# EAGLE design controle digital (EAGLE 4.09)
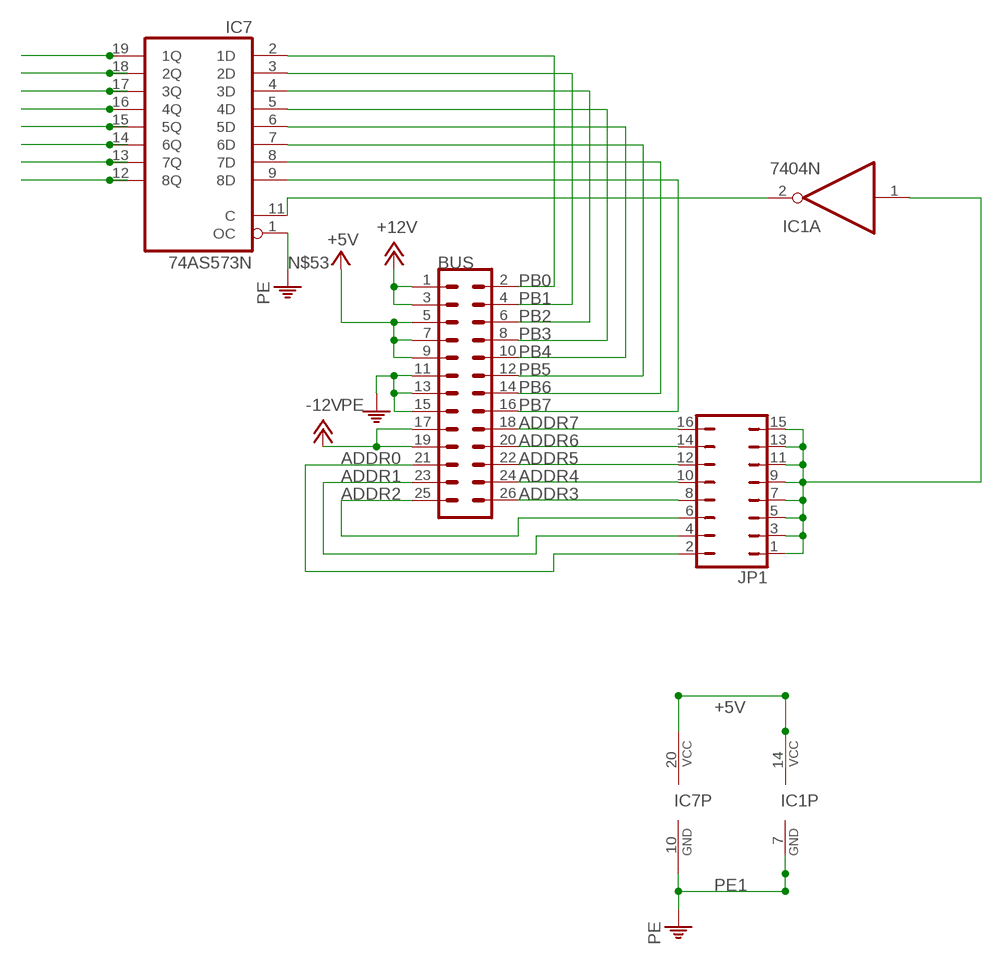
[diagram p0: schematic, sheet 1]

## Parts
BUS  ML26  [ML26]
IC1  7404N  [DIL14]
IC7  74AS573N  [DIL20]
JP1  JP8Q  [JP8Q]

## Nets
+5V: BUS.5 BUS.7 BUS.9 IC1.14(P:VCC) IC7.20(VCC)
+12V: BUS.1 BUS.3
-12V: BUS.17 BUS.19
ADDR0: BUS.21 JP1.2
ADDR1: BUS.23 JP1.4
ADDR2: BUS.25 JP1.6
ADDR3: BUS.26 JP1.8
ADDR4: BUS.24 JP1.10
ADDR5: BUS.22 JP1.12
ADDR6: BUS.20 JP1.14
ADDR7: BUS.18 JP1.16
N$1: IC7.19(1Q)
N$2: IC7.18(2Q)
N$3: IC7.17(3Q)
N$4: IC7.16(4Q)
N$5: IC7.15(5Q)
N$6: IC7.14(6Q)
N$7: IC7.13(7Q)
N$8: IC7.12(8Q)
N$33: IC1.1(A:I) JP1.1 JP1.3 JP1.5 JP1.7 JP1.9 JP1.11 JP1.13 JP1.15
N$53: IC1.2(A:O) IC7.11(C)
PB0: BUS.2 IC7.2(1D)
PB1: BUS.4 IC7.3(2D)
PB2: BUS.6 IC7.4(3D)
PB3: BUS.8 IC7.5(4D)
PB4: BUS.10 IC7.6(5D)
PB5: BUS.12 IC7.7(6D)
PB6: BUS.14 IC7.8(7D)
PB7: BUS.16 IC7.9(8D)
PE1: BUS.11 BUS.13 BUS.15 IC1.7(P:GND) IC7.1(OC) IC7.10(GND) ; supply symbol labelled PE
Unconnected: IC1.3(B:I) IC1.4(B:O) IC1.5(C:I) IC1.6(C:O) IC1.8(D:O) IC1.9(D:I) IC1.10(E:O) IC1.11(E:I) IC1.12(F:O) IC1.13(F:I)

## Library data of the parts
BUS = con-harting-ml:ML26: HARTING
IC1 = 74xx-us:74*04: Hex INVERTER
IC7 = 74xx-us:74*573: 8-bit D latch BUS DRIVER
JP1 = jumper:JP8Q: JUMPER

## Board
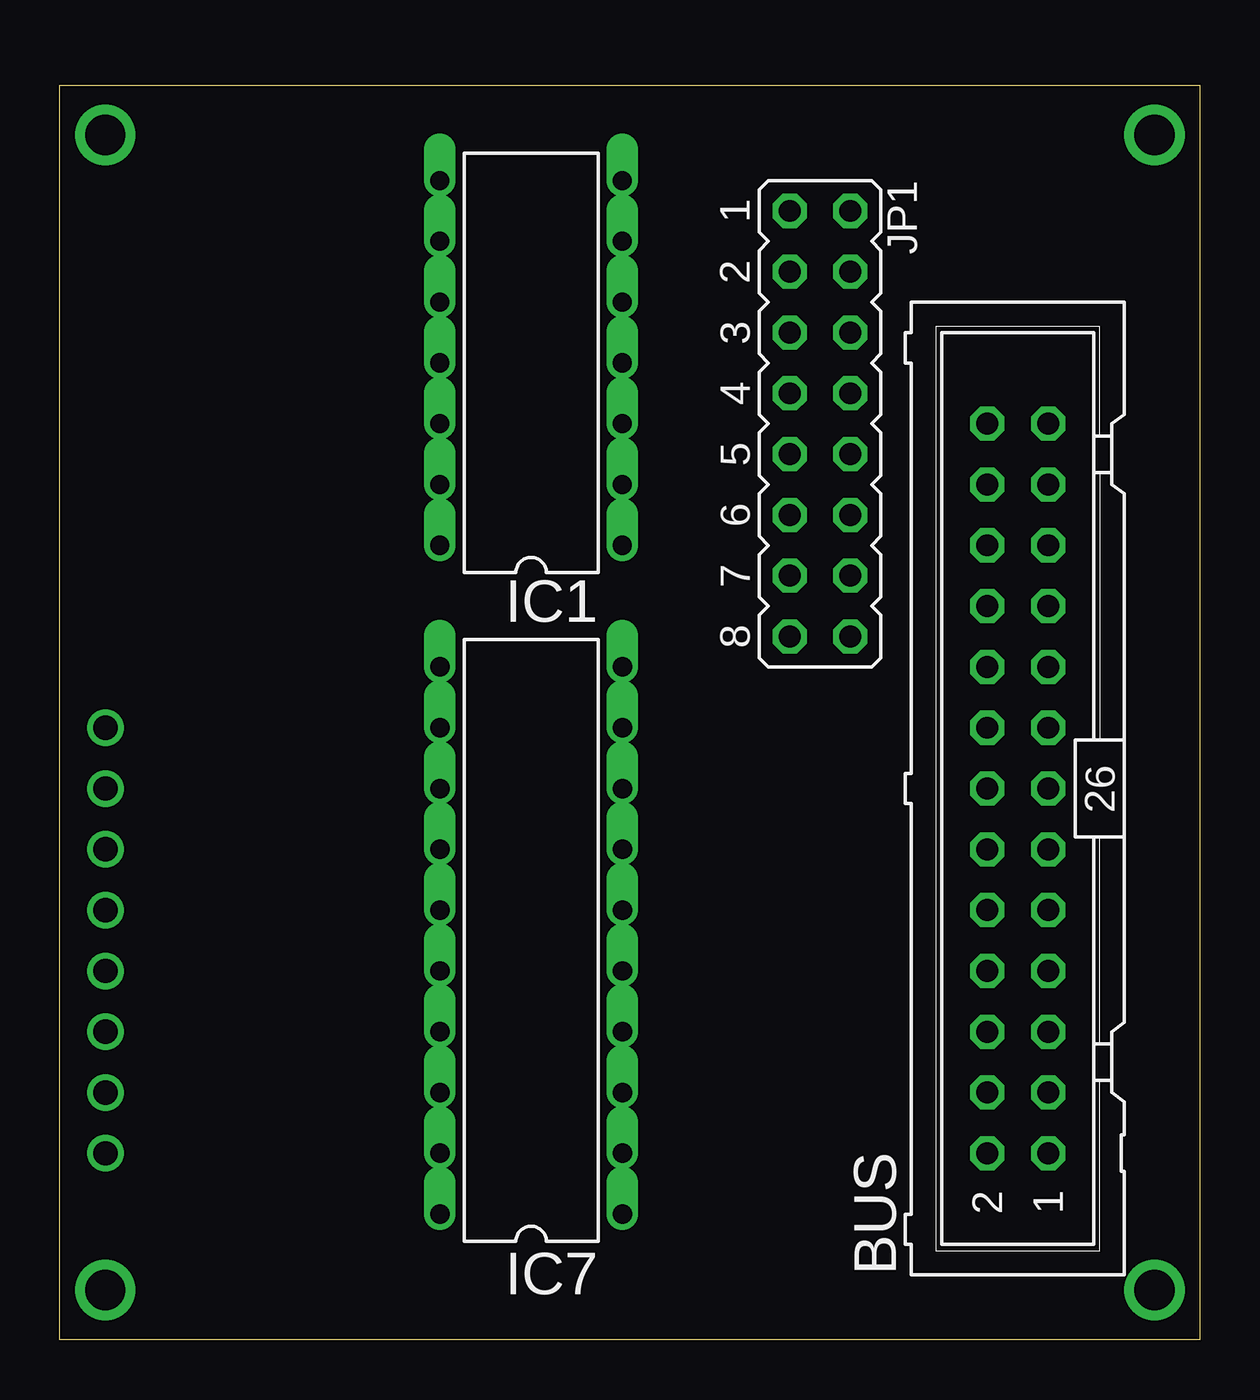
[diagram p1: board, top side]
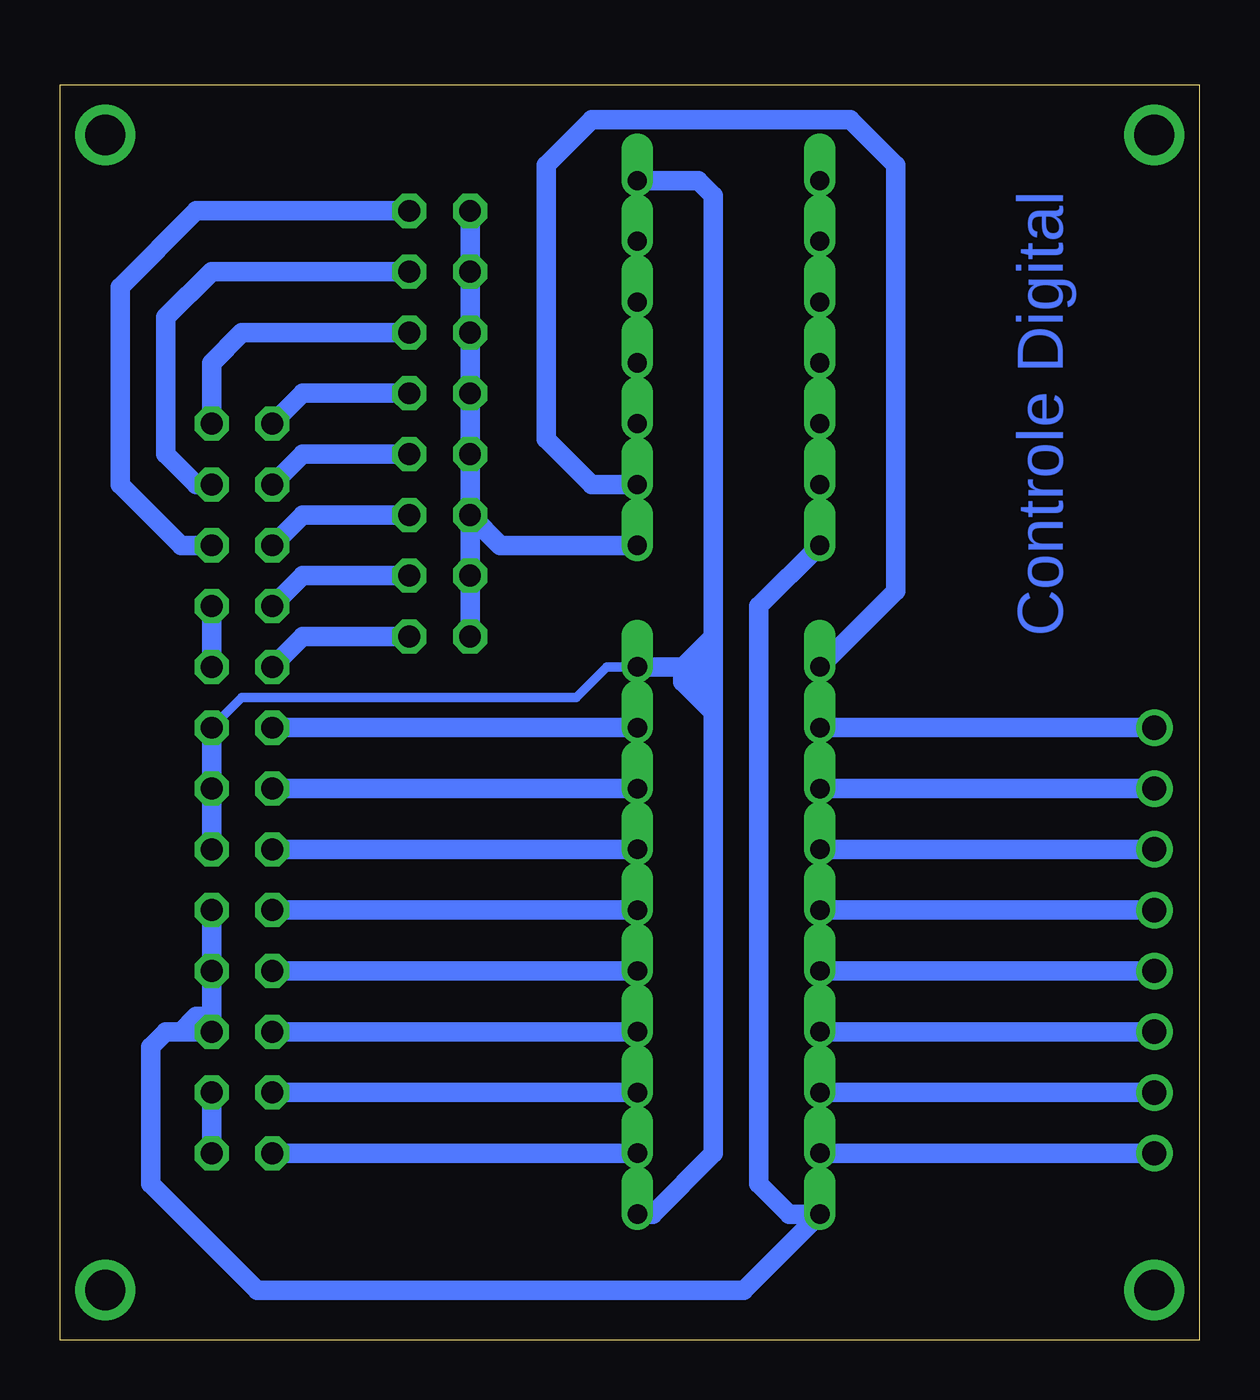
[diagram p2: board, bottom side, seen from below]

Size 47.6 x 52.4 mm. Coordinates in mm from the lower left corner, seen from the top.
Outline: 0,52.4 47.6,52.4 47.6,0 0,0 0,52.4
Copper layers used: Bottom

### Footprints (pad centres in the part's own frame; a part is rotated, then mirrored left to right if it is on the bottom)
ML26 = drill 0.914 octagon: 1 -15.24,-1.27; 2 -15.24,1.27; 3 -12.7,-1.27; 4 -12.7,1.27; 5 -10.16,-1.27; 6 -10.16,1.27; 7 -7.62,-1.27; 8 -7.62,1.27; 9 -5.08,-1.27; 10 -5.08,1.27; 11 -2.54,-1.27; 12 -2.54,1.27; 13 0,-1.27; 14 0,1.27; 15 2.54,-1.27; 16 2.54,1.27; 17 5.08,-1.27; 18 5.08,1.27; 19 7.62,-1.27; 20 7.62,1.27; 21 10.16,-1.27; 22 10.16,1.27; 23 12.7,-1.27; 24 12.7,1.27; 25 15.24,-1.27; 26 15.24,1.27
DIL14 = drill 0.8 offset: 1 -7.62,-3.81; 2 -5.08,-3.81; 3 -2.54,-3.81; 4 0,-3.81; 5 2.54,-3.81; 6 5.08,-3.81; 7 7.62,-3.81; 8 7.62,3.81; 9 5.08,3.81; 10 2.54,3.81; 11 0,3.81; 12 -2.54,3.81; 13 -5.08,3.81; 14 -7.62,3.81
DIL20 = drill 0.813 offset: 1 -11.43,-3.81; 2 -8.89,-3.81; 3 -6.35,-3.81; 4 -3.81,-3.81; 5 -1.27,-3.81; 6 1.27,-3.81; 7 3.81,-3.81; 8 6.35,-3.81; 9 8.89,-3.81; 10 11.43,-3.81; 11 11.43,3.81; 12 8.89,3.81; 13 6.35,3.81; 14 3.81,3.81; 15 1.27,3.81; 16 -1.27,3.81; 17 -3.81,3.81; 18 -6.35,3.81; 19 -8.89,3.81; 20 -11.43,3.81
JP8Q = drill 0.914 octagon: 1 -8.89,-1.27; 2 -8.89,1.27; 3 -6.35,-1.27; 4 -6.35,1.27; 5 -3.81,-1.27; 6 -3.81,1.27; 7 -1.27,-1.27; 8 -1.27,1.27; 9 1.27,-1.27; 10 1.27,1.27; 11 3.81,-1.27; 12 3.81,1.27; 13 6.35,-1.27; 14 6.35,1.27; 15 8.89,-1.27; 16 8.89,1.27

### Placement (x,y rotation side)
BUS  40,23.02 90 top
IC1  19.68,40.8 90 top
IC7  19.68,16.67 90 top
JP1  31.75,38.26 270 top

### Tracks (layer width: path | path; a pad name or v marks a point on that pad's centre or on a via)
+5V
  Bottom 0.813: 41.27,13.5 BUS.7 BUS.9 | 41.27,13.5 BUS.5 42.54,12.86 | IC1.14 18.41,30.64 18.41,6.52 17.14,5.24 IC7.20 19.05,2.07 39.36,2.07 43.81,6.52 43.81,12.23 43.17,12.86 42.54,12.86 | 41.27,13.5 41.9,13.5 42.54,12.86
+12V
  Bottom 0.813: BUS.3 BUS.1
-12V
  Bottom 0.813: BUS.19 41.27,29.37 BUS.17
ADDR0
  Bottom 0.813: BUS.21 42.54,33.18 45.08,35.72 45.08,43.98 41.9,47.15 JP1.2
ADDR1
  Bottom 0.813: BUS.23 41.9,35.72 43.17,36.99 43.17,42.71 41.27,44.61 JP1.4
ADDR2
  Bottom 0.813: 41.27,38.9 BUS.25 41.27,40.8 40,42.07 JP1.6
ADDR3
  Bottom 0.813: JP1.8 37.46,39.53 BUS.26
ADDR4
  Bottom 0.813: JP1.10 37.46,36.99 BUS.24
ADDR5
  Bottom 0.813: JP1.12 37.46,34.45 BUS.22
ADDR6
  Bottom 0.813: JP1.14 37.46,31.91 BUS.20
ADDR7
  Bottom 0.813: JP1.16 37.46,29.37 BUS.18
N$1  (via drill 1.02)
  Bottom 0.813: IC7.19 v1.9,7.78
N$2  (via drill 1.02)
  Bottom 0.813: IC7.18 v1.9,10.32
N$3  (via drill 1.02)
  Bottom 0.813: IC7.17 v1.9,12.86
N$4  (via drill 1.02)
  Bottom 0.813: IC7.16 v1.9,15.4
N$5  (via drill 1.02)
  Bottom 0.813: IC7.15 v1.9,17.94
N$6  (via drill 1.02)
  Bottom 0.813: IC7.14 v1.9,20.48
N$7  (via drill 1.02)
  Bottom 0.813: IC7.13 v1.9,23.02
N$8  (via drill 1.02)
  Bottom 0.813: IC7.12 v1.9,25.56
N$9  (via drill 1.68)
  other vias: 1.9,50.33
N$10  (via drill 1.68)
  other vias: 1.9,2.07
N$11  (via drill 1.68)
  other vias: 45.71,50.33
N$12  (via drill 1.68)
  other vias: 45.71,2.07
N$33
  Bottom 0.813: JP1.1 JP1.3 JP1.5 JP1.7 JP1.9 JP1.11 | JP1.15 JP1.13 JP1.11 | IC1.1 29.21,33.18 JP1.11
N$53
  Bottom 0.813: IC7.11 12.69,31.28 12.69,49.06 14.6,50.96 25.39,50.96 27.3,49.06 27.3,37.63 25.39,35.72 IC1.2
PB0
  Bottom 0.813: BUS.2 IC7.2
PB1
  Bottom 0.813: BUS.4 IC7.3
PB2
  Bottom 0.813: BUS.6 IC7.4
PB3
  Bottom 0.813: BUS.8 IC7.5
PB4
  Bottom 0.813: BUS.10 IC7.6
PB5
  Bottom 0.813: BUS.12 IC7.7
PB6
  Bottom 0.813: BUS.14 IC7.8
PB7
  Bottom 0.813: BUS.16 IC7.9
PE1
  Bottom 0.406: BUS.15 40,26.83 26.03,26.83 24.76,28.1 IC7.10
  Bottom 0.813: BUS.15 BUS.13 BUS.11 | 20.32,29.37 20.32,47.79 20.95,48.42 IC1.7 | 20.32,29.37 21.59,28.1 | 21.59,28.1 IC7.10 | 21.59,28.1 20.32,28.1 20.32,26.2 | 20.32,26.2 20.32,7.78 22.86,5.24 IC7.1 | 20.32,29.37 20.32,26.2 | 20.32,26.2 21.59,27.47 21.59,28.1 | 21.59,28.1 20.95,27.47

### Text on the board
Bottom: Controle Digital